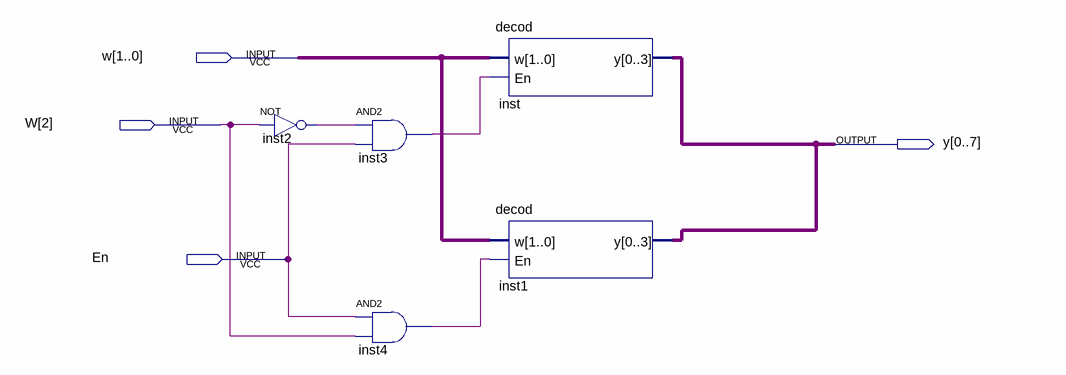
[diagram p0: schematic sheet]
// Quartus schematic 3to8.bdf as structural Verilog: 5 symbols, 4 pins
module \3to8  (
  input  [2:0] W,
  input  En,
  output [0:7] y
);

  wire inst2_out, inst3_out, inst4_out;

  not inst2 (inst2_out, W[2]);
  and inst3 (inst3_out, inst2_out, En);
  and inst4 (inst4_out, En, W[2]);
  decod inst (.w(W[1:0]), .En(inst3_out), .y(y));
  decod inst1 (.w(W[1:0]), .En(inst4_out), .y(y));
endmodule
